# EAGLE design SNESModule_r1 (EAGLE 7.7.0)
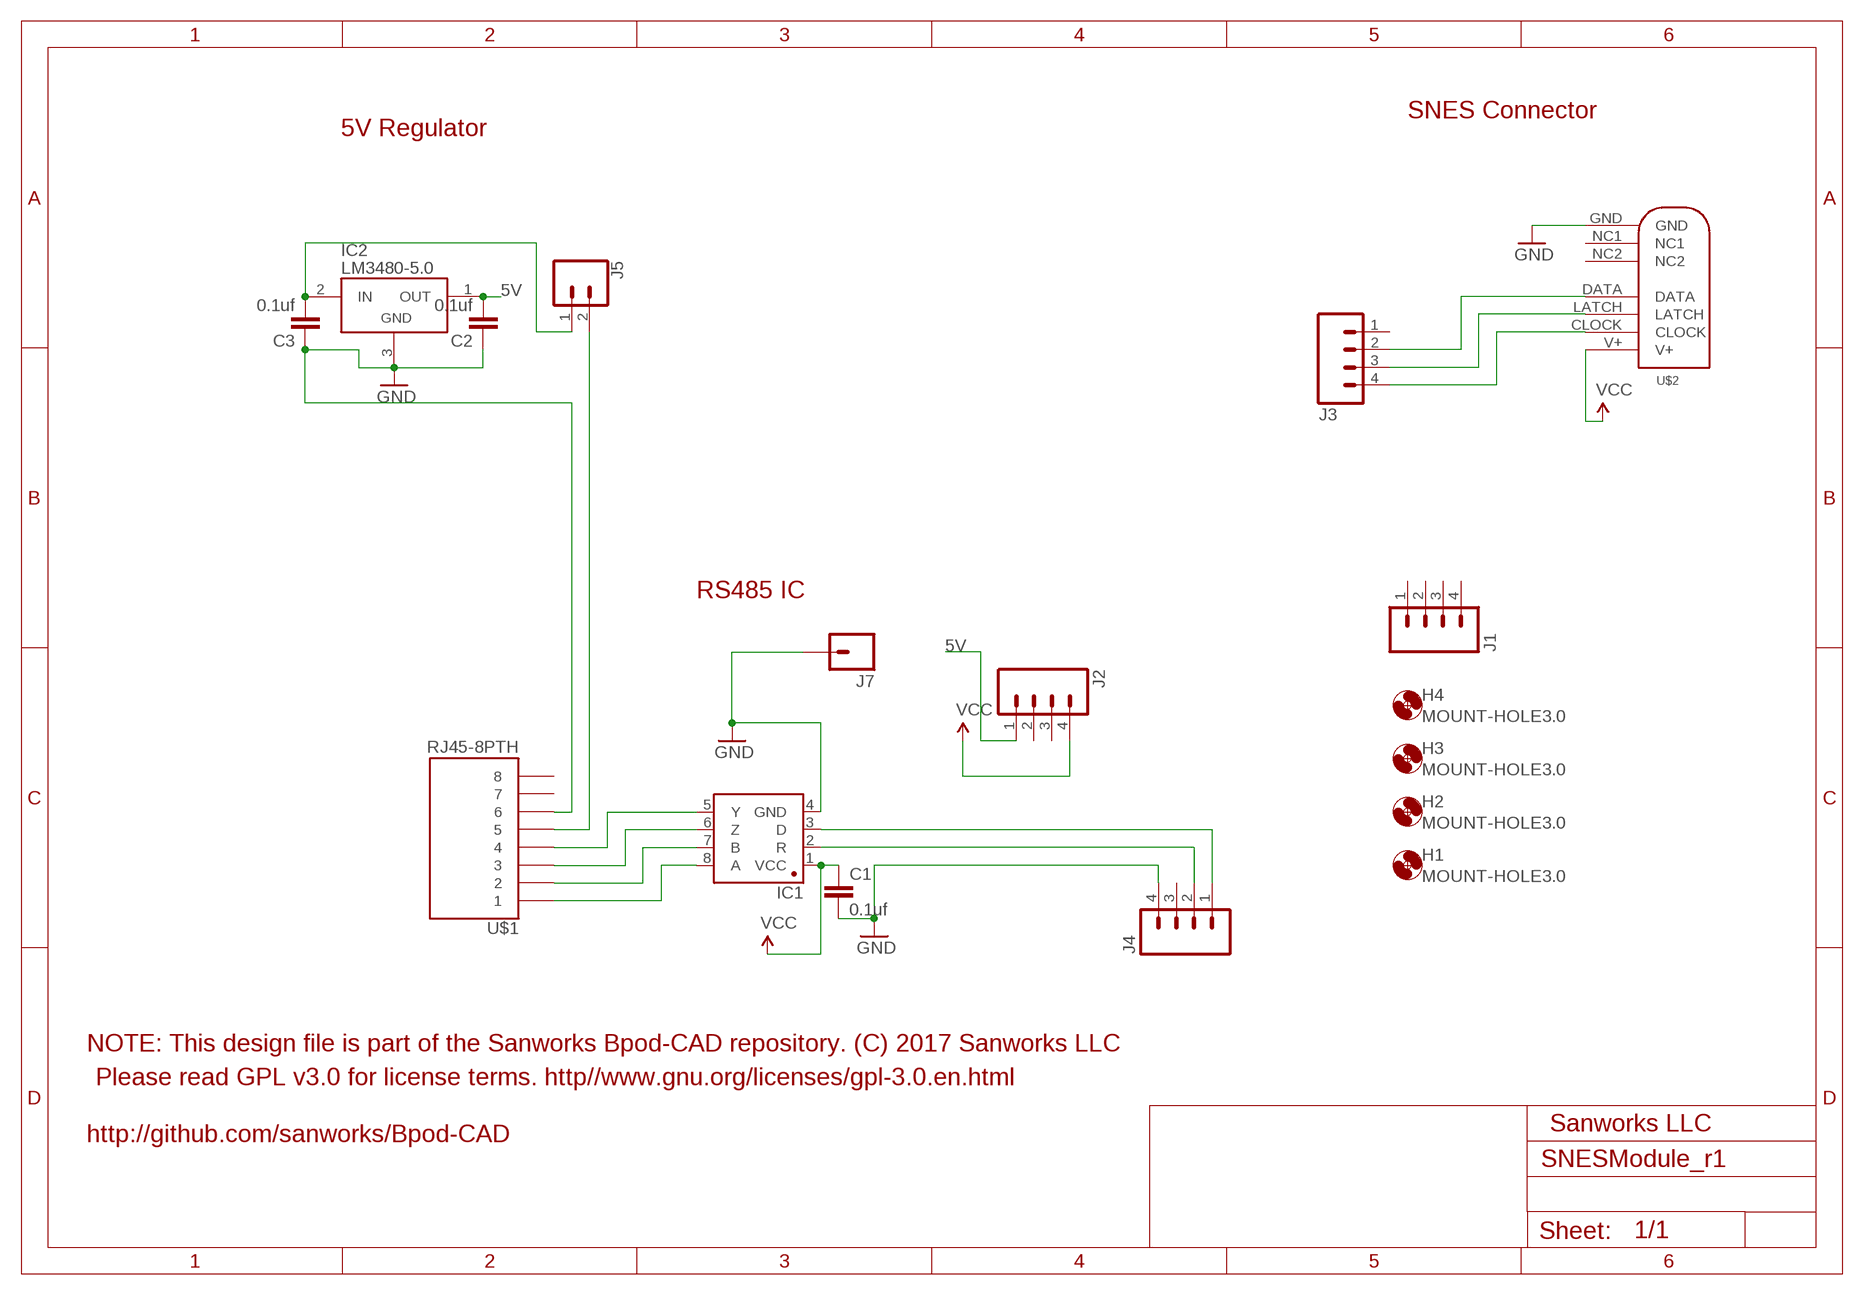
[diagram p0: schematic, sheet 1]

## Parts
C1  0.1uf  CAP1206  [1206]
C2  0.1uf  CAP1206  [1206]
C3  0.1uf  CAP1206  [1206]
H1  MOUNT-HOLE3.0  [3,0]
H2  MOUNT-HOLE3.0  [3,0]
H3  MOUNT-HOLE3.0  [3,0]
H4  MOUNT-HOLE3.0  [3,0]
IC1  SN65HVD31DR  [SO08]
IC2  LM3480-5.0  [SOT-23-3]
J1  M04PTH  [1X04]
J2  M04PTH  [1X04]
J3  M04PTH  [1X04]
J4  M04PTH  [1X04]
J5  CONN_02  [1X02]
J7  M01PTH  [1X01]
U$1  RJ45-8PTH  [RJ45-8]
U$2  SNES_CONNECTOR  [SNES_CONNECTOR]

## Nets
5V: C2.2 IC2.1(OUT) J2.1
GND: C1.2 C2.1 C3.1 IC1.4(GND) IC2.3(GND) J4.4 J7.1 U$1.6 U$2.GND
N$1: J3.2 U$2.DATA
N$2: J3.3 U$2.LATCH
N$3: J3.4 U$2.CLOCK
N$4: IC1.3(D) J4.1
N$6: IC1.2(R) J4.2
N$7: IC1.8(A) U$1.1
N$8: IC1.7(B) U$1.2
N$9: IC1.6(Z) U$1.3
N$10: IC1.5(Y) U$1.4
N$24: J5.2 U$1.5
N$26: C3.2 IC2.2(IN) J5.1
VCC: C1.1 IC1.1(VCC) J2.4 U$2.V+
Unconnected: J1.1 J1.2 J1.3 J1.4 J2.2 J2.3 J3.1 J4.3 U$1.7 U$1.8 U$2.NC1 U$2.NC2

## Notes on the sheet
- SNES Connector
- 5V Regulator
- 5V
- RS485 IC
- 5V
- NOTE: This design file is part of the Sanworks Bpod-CAD repository. (C) 2017 Sanworks LLC
- Please read GPL v3.0 for license terms. http//www.gnu.org/licenses/gpl-3.0.en.html
- Sanworks LLC
- http://github.com/sanworks/Bpod-CAD

## Library data of the parts
C1-C3 = SparkFun-Capacitors:CAP: Capacitor Standard 0603 ceramic capacitor, and 0.1" leaded capacitor.
H1-H4 = holes:MOUNT-HOLE: MOUNTING HOLE with drill center marker
IC1 = Joshparts4:SN65HVD31DR: A placeholder for generic narrow & wide SOIC8 foorptints - used on the DIP adapter board.
IC2 = regulators:LM3480-*: National Semiconductor LM3480 100 mA, SOT-23, quasi-LDO linear regulator
J1-J4 = SparkFun-Connectors:M04: Header 4 Standard 4-pin 0.1" header. Use with straight break away headers (SKU : PRT-00116), right angle break away headers (PRT-00553), swiss pins (PRT-00743), machine pins (PRT-00117), and female headers (PRT-00115). Molex polarized connector foot print use with SKU : PRT-08231 with associated crimp pins and housings. 1MM SMD Version SKU: PRT-10208; PROD_ID: CONN-09696
J5 = SparkFun-Connectors:CONN_02: Multi connection point. Often used as Generic Header-pin footprint for 0.1 inch spaced/style header connections On any of the 0.1 inch spaced packages, you can populate with these: Break Away Headers - Straight <https://www.sparkfun.com/products/116> (PRT-00116) Break Away Male Headers - Right Angle <https://www.sparkfun.com/products/553> (PRT-00553) Female Headers <https://www.sparkfun.com/products/115> (PRT-00115) Break Away Headers - Machine Pin <https://www.sparkfun.com/products/117> (PRT-00117) Break Away Female Headers - Swiss Machine Pin <https://www.sparkfun.com/products/743> (PRT-00743) For SCREWTERMINALS and SPRING TERMINALS visit here: Screw Terimnals on SparkFun.com <https://www.sparkfun.com/search/results?term=Screw+Terminals> (5mm/3.5mm/2.54mm spacing) This device is also useful as a general connection point to wire up your design to another part of your project. Our various solder wires solder well into these plated through hole pads. Hook-Up Wire - Assortment (Stranded, 22 AWG) <https://www.sparkfun.com/products/11375> (PRT-11375) Hook-Up Wire - Assortment (Solid Core, 22 AWG) <https://www.sparkfun.com/products/11367> (PRT-11367) View the entire wire category on our website here <https://www.sparkfun.com/categories/141> Special notes: Molex polarized connector foot print use with: PRT-08233 with associated crimp pins and housings. 2.54_SCREWTERM for use with PRT-10571. 3.5mm Screw Terminal footprints for PRT-08084 5mm Screw Terminal footprints for use with PRT-08432
J7 = SparkFun-Connectors:M01: Header 1 Standard 1-pin 0.1" header. Use with straight break away headers (SKU : PRT-00116), right angle break away headers (PRT-00553), swiss pins (PRT-00743), machine pins (PRT-00117), and female headers (PRT-00115). SMTSO-256-ET is a "flush mount" nut for a 4-40 screw. The older package used to be too tight, and did not allow it to sit properly thru the drill hit. The latest (0.165DIA) fits nice and snug.
U$1 = SparkFun:RJ45-8: RJ45 Jack Simple RJ45, 8-pin connection - connector for common Cat5, Cat5e, and Cat6 Ethernet cables. Footprint not yet proven in production. Connector sku is PRT-00643; Breakout PCB sku is BOB-00716.
U$2 = JoshParts10:SNES_CONNECTOR

## Board
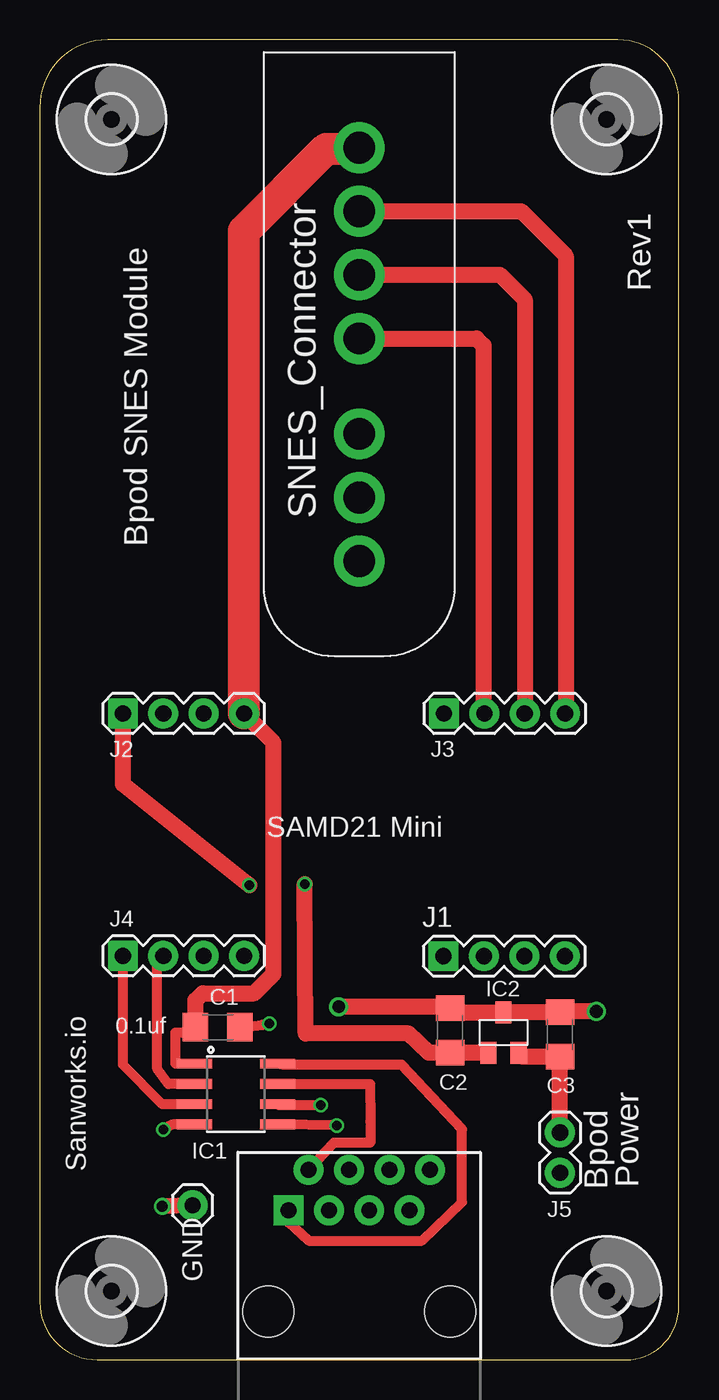
[diagram p1: board, top side]
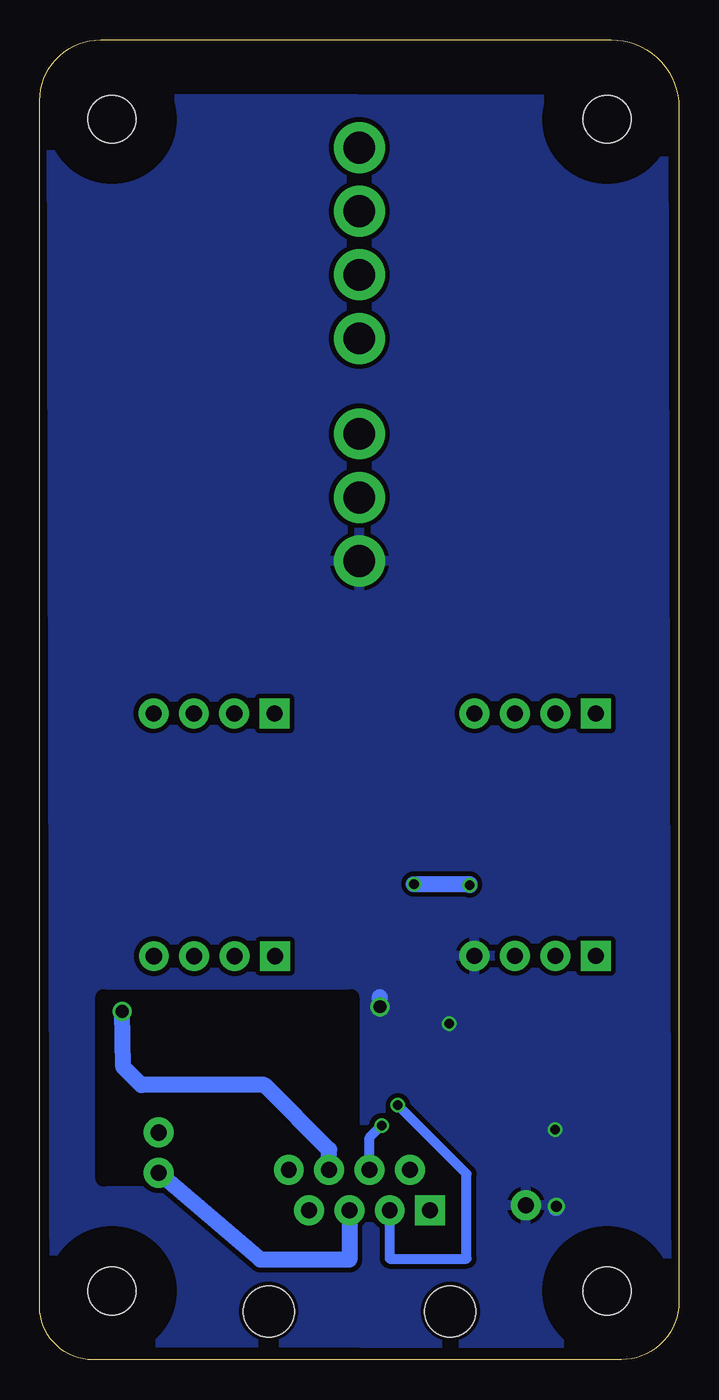
[diagram p2: board, bottom side, seen from below]

Size 40.2 x 83 mm. Coordinates in mm from the lower left corner, seen from the top.
Outline: 0,78.74 0,3.63 arc90 3.63,0 36.87,0 arc90 40.2,3.33 40.2,79.17 arc90 36.38,83 4.26,83 arc90 0,78.74
Copper layers (1*16): Top 0.035mm / dielectric 1.5mm / Bottom 0.035mm
Design rules "SeeedStudio_2layer_DRU_no_angle_20140221 *": minimum track width 6mil, minimum drill 12mil, track to track 12mil, track to pad 12mil, pad to pad 12mil, via to via 12mil, smd to smd 0mil, copper to edge 10mil, drill to drill 10mil, minimum pad ring 10mil, minimum via ring 6mil, stop-mask expansion 2mil, vias tented up to drill 100mil, thermal gap 10mil
bRestrict: area 20.6,11.4 to 36.2,22.8

### Footprints (pad centres in the part's own frame; a part is rotated, then mirrored left to right if it is on the bottom)
1206 = smd 1.6 x 1.8: 1 -1.4,0; 2 1.4,0
3,0 = hole 3: 0,0
SO08 = smd 0.61 x 2.21: 1 -1.905,-2.616; 2 -0.635,-2.616; 3 0.635,-2.616; 4 1.905,-2.616; 5 1.905,2.616; 6 0.635,2.616; 7 -0.635,2.616; 8 -1.905,2.616
SOT-23-3 = smd 1.016 x 1.397: 1 -0.953,-1.27; 2 0.953,-1.27; 3 0,1.27
1X04 = drill 1.016 pad 1.88 square: 1 0,0 | drill 1.016 pad 1.88: 2 2.54,0; 3 5.08,0; 4 7.62,0
1X02 = drill 1.016 pad 1.88: 1 0,0; 2 2.54,0
1X01 = drill 1.016 pad 1.88: 1 0,0
RJ45-8 = drill 1 pad 1.88 square: 1 -4.445,6.35 | drill 1 pad 1.88: 2 -3.175,8.89; 3 -1.905,6.35; 4 -0.635,8.89; 5 0.635,6.35; 6 1.905,8.89; 7 3.175,6.35; 8 4.445,8.89 | hole 3.2: -5.715,0; 5.715,0
SNES_CONNECTOR = drill 2 pad 3.2: CLOCK 22,0; DATA 14,0; GND 0,0; LATCH 18,0; NC1 4,0; NC2 8,0; V+ 26,0

### Placement (x,y rotation side)
C1  11.2,20.91 0 top
C2  25.81,20.7 270 top
C3  32.73,20.45 270 top
H1  4.52,4.32 0 top
H2  35.66,4.32 0 top
H3  35.66,78 0 top
H4  4.52,78 0 top
IC1  12.34,16.71 270 top
IC2  29.17,20.57 0 top
J1  25.4,25.38 0 top
J2  5.23,40.64 0 top
J3  25.43,40.64 0 top
J4  5.23,25.4 0 top
J5  32.73,14.29 270 top
J7  9.61,9.72 0 top
U$1  20.09,3.05 0 top
U$2  20.1,50.22 90 top

### Tracks (layer width: path | path; a pad name or v marks a point on that pad's centre or on a via)
5V  (via drill 0.6)
  Top 1: IC2.1 C2.2 | C2.2 | C2.2 24.47,19.3 23.2,20.51 16.73,20.51 v16.66,29.91 | v13.17,29.84 5.23,36.2 J2.1
  Bottom 1: v16.66,29.91 13.17,29.91 v13.17,29.84
GND  (via drill 0.6, 0.7, 0.8)
  Top 0.635: IC1.4 8.35,14.8 v7.77,14.48 | C1.2 14.02,21.06 v14.44,21.14
  Top 1: v35.01,21.91 32.91,21.91 C3.1 29.49,21.85 IC2.3 26.06,21.84 C2.1 25.68,21.91 25.39,22.2 v18.8,22.2
  Top 1.016: J7.1 v7.71,9.65
  Bottom 1: U$1.6 22,13.21 26.06,17.27 33.81,17.27 34.95,18.41 v35.01,21.91 | v18.8,22.2 18.8,22.8
  Bottom 1.016: v7.71,9.65 7.71,9.53
  pour Bottom: 0.79,1.02 39.27,1.08 39.45,79.31 0.97,79.25
N$1
  Top 1: U$2.DATA 27.48,64.22 27.92,63.78 27.92,40.69 J3.2
N$2
  Top 1: U$2.LATCH 28.94,68.22 30.5,66.66 J3.3
N$3
  Top 1: U$2.CLOCK 30.28,72.22 33.08,69.42 33.08,40.67 J3.4
N$4
  Top 0.635: IC1.3 7.7,16.07 5.23,18.54 J4.1
N$6
  Top 0.635: IC1.2 8.08,17.34 7.39,18.29 7.39,25.02 J4.2
N$7
  Top 0.635: U$1.1 15.65,8.64 16.92,7.49 24.03,7.49 26.57,9.91 26.57,14.48 22.76,18.54 15.28,18.54 IC1.8
N$8
  Top 0.635: IC1.7 20.78,17.34 20.79,14.99 20.79,13.65 18.5,13.65 U$1.2
N$9  (via drill 0.6)
  Top 0.635: v17.68,16 15.02,16 IC1.6
  Bottom 0.635: U$1.3 18.19,6.35 13.36,6.35 13.36,11.68 v17.68,16
N$10  (via drill 0.6)
  Top 0.635: v18.69,14.73 IC1.5
  Bottom 0.635: U$1.4 19.46,13.97 v18.69,14.73
N$24
  Bottom 1: U$1.5 20.73,6.29 26.31,6.29 J5.2
N$26
  Top 1: J5.1 C3.2 30.38,19.05 IC2.2
VCC
  Top 0.635: IC1.1 8.53,18.61 8.53,20.57 9.8,20.57 C1.1
  Top 1: C1.1 9.8,22.6 10.25,23.05 13.49,23.05 14.69,24.26 14.69,38.8 J2.4
  Top 2: J2.4 12.85,70.97 18.02,76.14 20.7,76.14 U$2.V+

### Text on the board
tPlace: Bpod SNES Module | Rev1 | SNES_Connector | SAMD21 Mini | Sanworks.io | 0.1uf | Power | Bpod | GND